# Altium schematic sheet Perpherials.SchDoc: Perpherials
size Letter; Organization: PulseOut COVID; Address1: By: C. Miller; Address2: pulseoutcovid.com; DocumentNumber: 1; Revision: 0; SheetNumber: 5; SheetTotal: 5
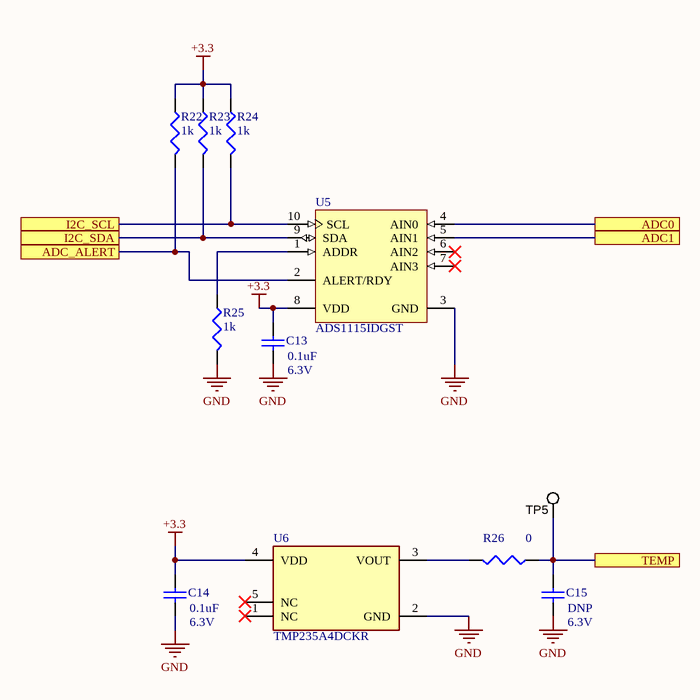
[diagram p0: Perpherials.SchDoc]

## Parts
C13  value 0.1uF  Voltage: 6.3V  [1608[0603]]  (hidden comment: Cap Semi)
C14  value 0.1uF  Voltage: 6.3V  [1608[0603]]  (hidden comment: Cap Semi)
C15  value DNP  Voltage: 6.3V  [1608[0603]]  (hidden comment: Cap Semi)
R22  value 1k  [J1-0603]  (hidden comment: Res3)
R23  value 1k  [J1-0603]  (hidden comment: Res3)
R24  value 1k  [J1-0603]  (hidden comment: Res3)
R25  value 1k  [J1-0603]  (hidden comment: Res3)
R26  value 0  [J1-0603]  (hidden comment: Res3)
TP5  5002  [Keystone5002]  (value not drawn)
U5  ADS1115IDGST  [TI-DGS10_M]
U6  TMP235A4DCKR  [FP-DCK0005A-MFG]

## Ports
ADC0, ADC1, ADC_ALERT, I2C_SCL, I2C_SDA, TEMP

## Nets
+3.3: C13.2 C14.2 R22.1 R23.1 R24.1 U5.8(VDD) U6.4(VDD)
GND: C13.1 C14.1 C15.1 R25.2 U5.3(GND) U6.2(GND)
ADC0: U5.4(AIN0) ; port ADC0
ADC1: U5.5(AIN1) ; port ADC1
ADC_ALERT: R22.2 U5.2(ALERT/RDY) ; port ADC_ALERT
I2C_SCL: R24.2 U5.10(SCL) ; port I2C_SCL
I2C_SDA: R23.2 U5.9(SDA) ; port I2C_SDA
TEMP: C15.2 R26.1 TP5.1 ; port TEMP
NetR25_1: R25.1 U5.1(ADDR)
NetR26_2: R26.2 U6.3(VOUT)

Not connected (* = marked no-connect by the designer): U5 6(AIN2)* 7(AIN3)*; U6 1(NC)* 5(NC)*

## Notes on the sheet
- Title
- Size:
- Date:
- Letter
- Number:
- Time:
- Revision:
- Sheet
- of
- File:

## Library data of the parts
C13 C14 = Cap Semi: Capacitor (Semiconductor SIM Model); MPN: 06036C104KAT4A; Manufacturer: AVX Corporation; Published: 8-Jun-2000; LatestRevisionDate: 29-May-2009; LatestRevisionNote: IPC-7351 Footprint Added.; PackageReference: C1206; Publisher: Altium Limited; PackageDescription: Chip Capacitor; DigiKey: 478-06036C104KAT4ACT-ND
C15 = Cap Semi: Capacitor (Semiconductor SIM Model); Published: 8-Jun-2000; LatestRevisionDate: 29-May-2009; LatestRevisionNote: IPC-7351 Footprint Added.; PackageReference: C1206; Publisher: Altium Limited; PackageDescription: Chip Capacitor; DigiKey: DNP
R22-R25 = Res3: Resistor; MPN: RC0603FR-071KL; Manufacturer: Yageo; Published: 8-Jun-2000; LatestRevisionDate: 29-May-2009; LatestRevisionNote: IPC-7351 Footprint Added.; PackageReference: J1-0603; Publisher: Altium Limited; PackageDescription: Chip Resistor; DigiKey: 311-1.00KHRCT-ND
R26 = Res3: Resistor; MPN: RC0603JR-070RL; Manufacturer: Yageo; Published: 8-Jun-2000; LatestRevisionDate: 29-May-2009; LatestRevisionNote: IPC-7351 Footprint Added.; PackageReference: J1-0603; Publisher: Altium Limited; PackageDescription: Chip Resistor; DigiKey: 311-0.0GRCT-ND
TP5 = 5002: Test Point, Miniature, White, TH; Manufacturer: Keystone; CompType: Test Point Loop; U/M: EA; SymbolVersion: 2008-04-04; PartNumber: 5002; PackageReference: White Miniature Testpoint; RoHS: Y; MountType: TH; ComponentLink1Description: Datasheet Link; ComponentLink1URL: http://www.keyelco.com/userAssets/file/M60-2p60.pdf; Value: White; Publisher: Texas Instruments; LatestRevisionDate: 2015-08-25; Supplier 1: Digi-Key; DigiKey: 36-5002-ND; Supplier 2: Newark; Supplier Part Number 2: 82H9632; MPN: 5002
U5 = CMP-0003-00378-2: 16-Bit ADC with Integrated Multiplexer, PGA, Comparator, Oscillator, and Reference, -40 to 125 degC, 10-pin SOP (DGS10), Green (RoHS & no Sb/Br); Manufacturer: Texas Instruments; MPN: ADS1115IDGSR; Sample Rate (max)(SPS): 860; SubFamily: Precision ADC (<=10MSPS); Architecture: Delta-Sigma; Digital Supply(Min)(V): 2; Resolution(Bits): 16; Digital Supply(Max)(V): 5.5; INL(Max)(+/-LSB): 1; Interface: Serial I2C; # Input Channels: 4; Eco-Plan: Green (RoHS & no Sb/Br); PackageDescription: 10-Pin Plastic Small Outline, Body 3 x 3 mm, Pitch 0.5 mm; Mounting Technology: Surface Mount; PackageReference: DGS10; DatasheetVersion: SBAS444B; ComponentLink3Description: Package Specification; ComponentLink1Description: Manufacturer URL; PartNumber: ADS1115IDGST; ComponentLink3URL: http://www.ti.com/lit/ml/mpds035b/mpds035b.pdf; ComponentLink2URL: http://www.ti.com/general/docs/lit/getliterature.tsp?genericPartNumber=ADS1115&fileType=pdf; Analog Voltage AV/DD(Min)(V): 2; ComponentLink2Description: Datasheet; PackageVersion: 4073272/C, 02/2004; Analog Voltage AV/DD(Max)(V): 5.5; Code_JEDEC: MO-153; ComponentLink1URL: http://www.ti.com/; DigiKey: 296-38849-1-ND
U6 = CMP-04948-000022-1: SENSOR ANALOG -40C-150C SC70-5; Manufacturer: Texas Instruments; Max Junction Temp: +150°C; Output Current: 500uA; Standoff Height: 0mm; Output Voltage: 100-2000mV; Operating Supply Current: 9-10uA; Min Supply Voltage: 2.3V; Sensor Output: Analog Voltage; Max Supply Voltage: 5.5V; Ambient Temperature Range High: +150°C; Manufacturer Part Number: TMP235A4DCKR; Temperature Range Low: -40°C; Temperature Range High: +150°C; Lead Free: Yes; Mouser Description: ±2.5°C Analog output temperature sensor, with 10mV /°C gain 5-SC70 -40 to 150; Height: 1.1mm; ComponentLink2Description: Datasheet; ComponentLink2URL: https://www.ti.com/lit/ds/symlink/tmp235.pdf; Device Class L1: Sensors; Ambient Temperature Range Low: -40°C; Temperature: -40°C to +150°C; Device Class L2: Temperature and Humidity Sensors; Category: IC; Digikey Description: SENSOR ANALOG -40C-150C SC70-5; Automotive: No; RoHS: TRUE; Device Class L3: unset; Package: DCK0005A; Octopart: https://octopart.com/tmp235a4dckr-texas+instruments-88184449; MPN: TMP235A4DCKR; DigiKey: 296-50016-1-ND